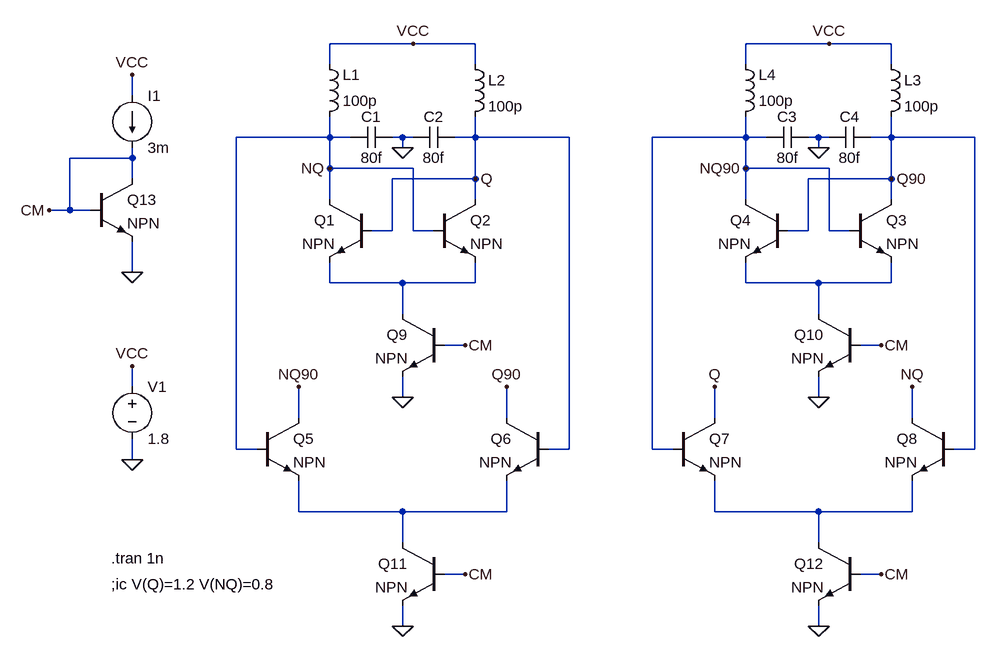
[diagram p0: schematic quadosc.asc]
quadosc.asc, the LTspice schematic file:
Version 4
SHEET 1 1152 864
WIRE 16 -128 -112 -128
WIRE 112 -128 16 -128
WIRE 656 -128 528 -128
WIRE 752 -128 656 -128
WIRE -112 -96 -112 -128
WIRE 112 -96 112 -128
WIRE 528 -96 528 -128
WIRE 752 -96 752 -128
WIRE -416 -48 -416 -80
WIRE -112 16 -112 -16
WIRE -112 16 -256 16
WIRE -80 16 -112 16
WIRE 0 16 -16 16
WIRE 16 16 0 16
WIRE 112 16 112 -16
WIRE 112 16 80 16
WIRE 256 16 112 16
WIRE 528 16 528 -16
WIRE 528 16 384 16
WIRE 560 16 528 16
WIRE 640 16 624 16
WIRE 656 16 640 16
WIRE 752 16 752 -16
WIRE 752 16 720 16
WIRE 880 16 752 16
WIRE 0 32 0 16
WIRE 640 32 640 16
WIRE -416 48 -416 32
WIRE -416 48 -512 48
WIRE -112 64 -112 16
WIRE 16 64 -112 64
WIRE 528 64 528 16
WIRE 656 64 528 64
WIRE -416 80 -416 48
WIRE 112 80 112 16
WIRE 112 80 -16 80
WIRE 752 80 752 16
WIRE 752 80 624 80
WIRE -112 112 -112 64
WIRE 112 112 112 80
WIRE 528 112 528 64
WIRE 752 112 752 80
WIRE -512 128 -512 48
WIRE -512 128 -544 128
WIRE -480 128 -512 128
WIRE -16 160 -16 80
WIRE -16 160 -48 160
WIRE 16 160 16 64
WIRE 48 160 16 160
WIRE 624 160 624 80
WIRE 624 160 592 160
WIRE 656 160 656 64
WIRE 688 160 656 160
WIRE -416 224 -416 176
WIRE -112 240 -112 208
WIRE 0 240 -112 240
WIRE 112 240 112 208
WIRE 112 240 0 240
WIRE 528 240 528 208
WIRE 640 240 528 240
WIRE 752 240 752 208
WIRE 752 240 640 240
WIRE 0 288 0 240
WIRE 640 288 640 240
WIRE 96 336 64 336
WIRE 736 336 704 336
WIRE -416 400 -416 368
WIRE 0 416 0 384
WIRE 640 416 640 384
WIRE -160 448 -160 400
WIRE 160 448 160 400
WIRE 480 448 480 400
WIRE 784 448 784 400
WIRE -256 496 -256 16
WIRE -224 496 -256 496
WIRE 256 496 256 16
WIRE 256 496 224 496
WIRE 384 496 384 16
WIRE 416 496 384 496
WIRE 880 496 880 16
WIRE 880 496 848 496
WIRE -416 512 -416 480
WIRE -160 592 -160 544
WIRE 0 592 -160 592
WIRE 160 592 160 544
WIRE 160 592 0 592
WIRE 480 592 480 544
WIRE 640 592 480 592
WIRE 784 592 784 544
WIRE 784 592 640 592
WIRE 0 640 0 592
WIRE 640 640 640 592
WIRE 96 688 64 688
WIRE 736 688 704 688
WIRE 0 768 0 736
WIRE 640 768 640 736
FLAG 0 32 0
FLAG 0 416 0
FLAG 112 80 Q
FLAG -112 64 NQ
FLAG 16 -128 VCC
FLAG -416 512 0
FLAG -416 368 VCC
FLAG 640 32 0
FLAG 640 416 0
FLAG 752 80 Q90
FLAG 528 64 NQ90
FLAG 656 -128 VCC
FLAG 0 768 0
FLAG 640 768 0
FLAG 160 400 Q90
FLAG -160 400 NQ90
FLAG 480 400 Q
FLAG 784 400 NQ
FLAG -416 224 0
FLAG -416 -80 VCC
FLAG 96 336 CM
FLAG 736 336 CM
FLAG 736 688 CM
FLAG 96 688 CM
FLAG -544 128 CM
SYMBOL npn 48 112 R0
SYMATTR InstName Q2
SYMBOL npn -48 112 M0
SYMATTR InstName Q1
SYMBOL cap -16 0 R90
WINDOW 0 0 32 VBottom 2
WINDOW 3 32 32 VTop 2
SYMATTR InstName C1
SYMATTR Value 80f
SYMBOL cap 80 0 R90
WINDOW 0 0 32 VBottom 2
WINDOW 3 32 32 VTop 2
SYMATTR InstName C2
SYMATTR Value 80f
SYMBOL ind 96 -112 R0
SYMATTR InstName L2
SYMATTR Value 100p
SYMBOL ind -128 0 M180
WINDOW 0 36 80 Left 2
WINDOW 3 36 40 Left 2
SYMATTR InstName L1
SYMATTR Value 100p
SYMBOL voltage -416 384 R0
WINDOW 123 0 0 Left 0
WINDOW 39 0 0 Left 0
SYMATTR InstName V1
SYMATTR Value 1.8
SYMBOL npn 688 112 R0
SYMATTR InstName Q3
SYMBOL npn 592 112 M0
SYMATTR InstName Q4
SYMBOL cap 624 0 R90
WINDOW 0 0 32 VBottom 2
WINDOW 3 32 32 VTop 2
SYMATTR InstName C3
SYMATTR Value 80f
SYMBOL cap 720 0 R90
WINDOW 0 0 32 VBottom 2
WINDOW 3 32 32 VTop 2
SYMATTR InstName C4
SYMATTR Value 80f
SYMBOL ind 736 -112 R0
SYMATTR InstName L3
SYMATTR Value 100p
SYMBOL ind 512 0 M180
WINDOW 0 36 80 Left 2
WINDOW 3 36 40 Left 2
SYMATTR InstName L4
SYMATTR Value 100p
SYMBOL npn -224 448 R0
SYMATTR InstName Q5
SYMBOL npn 224 448 M0
SYMATTR InstName Q6
SYMBOL npn 416 448 R0
SYMATTR InstName Q7
SYMBOL npn 848 448 M0
SYMATTR InstName Q8
SYMBOL npn 64 288 M0
SYMATTR InstName Q9
SYMBOL npn 704 288 M0
SYMATTR InstName Q10
SYMBOL npn 64 640 M0
SYMATTR InstName Q11
SYMBOL npn 704 640 M0
SYMATTR InstName Q12
SYMBOL npn -480 80 R0
SYMATTR InstName Q13
SYMBOL current -416 -48 R0
WINDOW 123 0 0 Left 0
WINDOW 39 0 0 Left 0
SYMATTR InstName I1
SYMATTR Value 3m
TEXT -448 664 Left 2 !.tran 1n
TEXT -448 704 Left 2 !;ic V(Q)=1.2 V(NQ)=0.8

The netlist it stands for:
* quadosc.asc
Q2 Q NQ N001 0 NPN
Q1 NQ Q N001 0 NPN
C1 0 NQ 80f
C2 Q 0 80f
L2 VCC Q 100p
L1 NQ VCC 100p
V1 VCC 0 1.8
Q3 Q90 NQ90 N002 0 NPN
Q4 NQ90 Q90 N002 0 NPN
C3 0 NQ90 80f
C4 Q90 0 80f
L3 VCC Q90 100p
L4 NQ90 VCC 100p
Q5 NQ90 NQ N003 0 NPN
Q6 Q90 Q N003 0 NPN
Q7 Q NQ90 N004 0 NPN
Q8 NQ Q90 N004 0 NPN
Q9 N001 CM 0 0 NPN
Q10 N002 CM 0 0 NPN
Q11 N003 CM 0 0 NPN
Q12 N004 CM 0 0 NPN
Q13 CM CM 0 0 NPN
I1 VCC CM 3m
.model NPN NPN
.model PNP PNP
.lib standard.bjt
.tran 1n
;ic V(Q)=1.2 V(NQ)=0.8
.backanno
.end